# Altium schematic sheet HashPower4.SchDoc: ANT_Miner_V1.3
size A4; Date: 2013/11/20; DrawnBy: Bitmain Technology; SheetNumber: 5; SheetTotal: 9
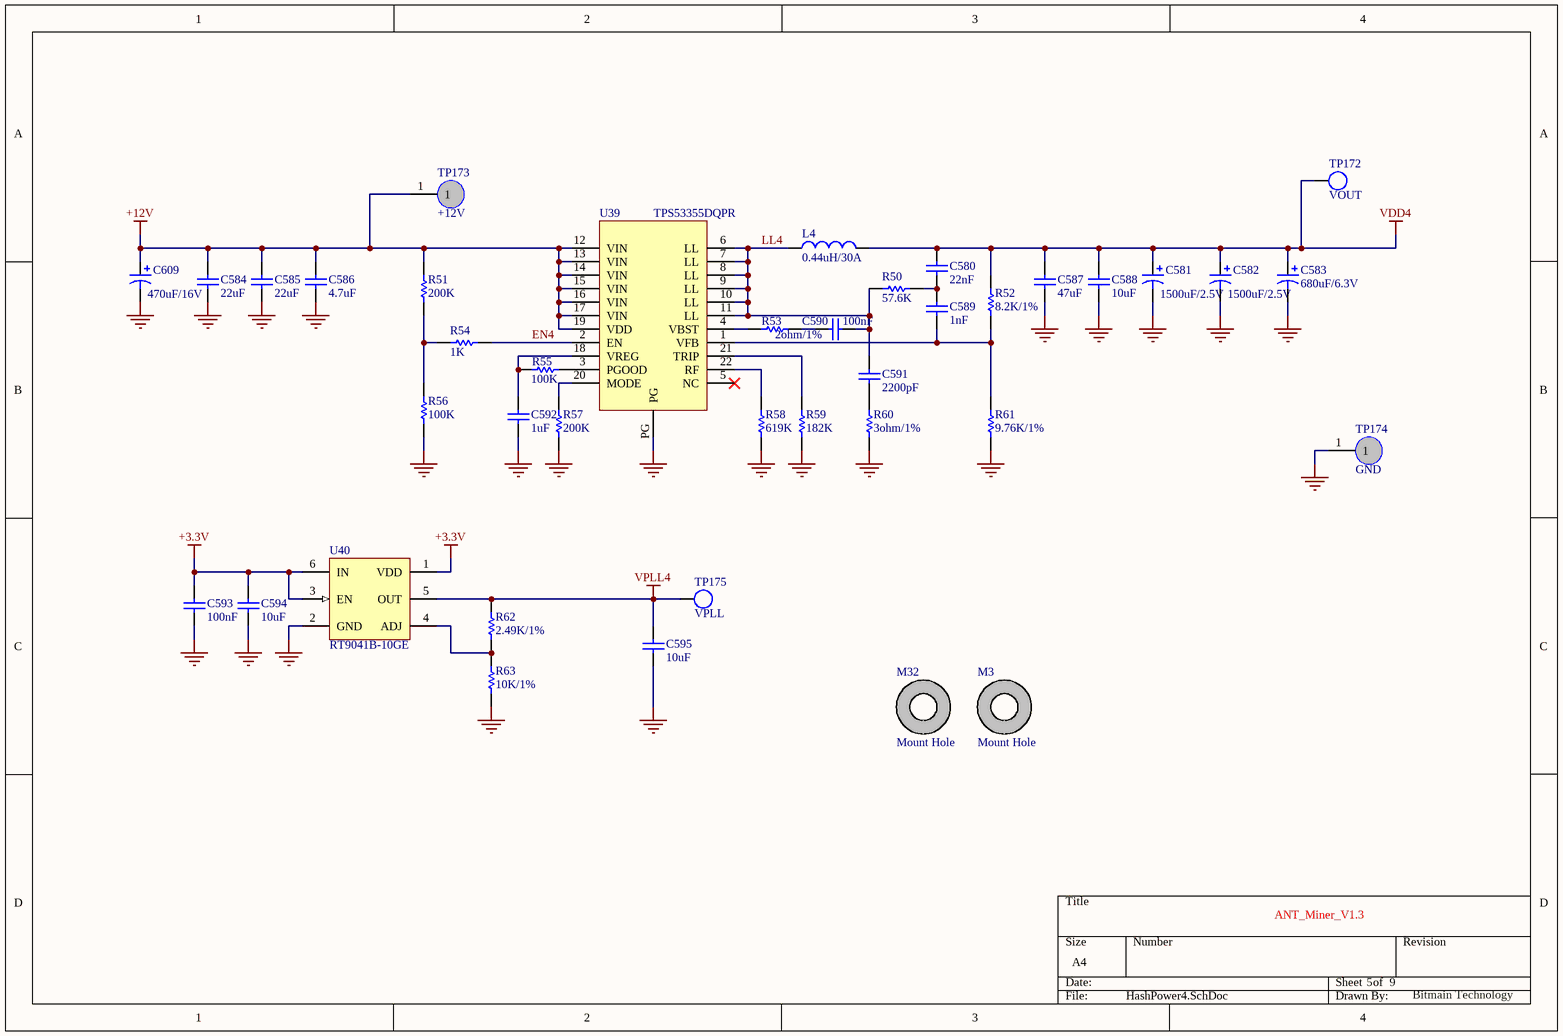
[diagram p0: HashPower4.SchDoc]

## Parts
C580  22nF  [CC0603(1608)]
C581  value 1500uF/2.5V  [F12]  (hidden comment: 1500uF/4V)
C582  value 1500uF/2.5V  [F12]  (hidden comment: 1500uF/4V)
C583  680uF/6.3V  [D]
C584  22uF  [CC1210(3225)]
C585  22uF  [CC1210(3225)]
C586  4.7uF  [CC0805(2012)]
C587  47uF  [CAPC3225L]
C588  10uF  [CAPC2012L]
C589  1nF  [CC0603(1608)]
C590  100nF  [CC0603(1608)]
C591  2200pF  [CC0603(1608)]
C592  1uF  [CC0603(1608)]
C593  100nF  [CC0603(1608)]
C594  10uF  [CC0805(2012)]
C595  10uF  [CC0805(2012)]
C609  470uF/16V  [E12]
L4  0.44uH/30A  [IHLP5050]
M3  Mount Hole  [HOLE_3.2]
M32  Mount Hole  [HOLE_3.2]
R50  57.6K  [RR0603(1608)]
R51  200K  [RR0603(1608)]
R52  8.2K/1%  [RR0603(1608)]
R53  value 2ohm/1%  [RR0603(1608)]  (hidden comment: 2)
R54  1K  [RR0603(1608)]
R55  100K  [RR0603(1608)]
R56  100K  [RR0603(1608)]
R57  200K  [RR0603(1608)]
R58  619K  [RR0603(1608)]
R59  182K  [RR0603(1608)]
R60  value 3ohm/1%  [RR0603(1608)]  (hidden comment: 3)
R61  9.76K/1%  [RR0603(1608)]
R62  2.49K/1%  [RR0603(1608)]
R63  10K/1%  [RR0603(1608)]
TP172  VOUT  [TP_SMD_1.0]
TP173  +12V  [TP]
TP174  GND  [TP]
TP175  VPLL  [TP_SMD_1.0]
U39  TPS53355DQPR  [TPS53355]
U40  RT9041B-10GE  [SOT23-6_L]

## Nets
+3.3V: C593.2 C594.2 U40.1(VDD) U40.3(EN) U40.6(IN)
+12V: C584.1 C585.1 C586.1 C609.1 R51.1 TP173.1 U39.12(VIN) U39.13(VIN) U39.14(VIN) U39.15(VIN) U39.16(VIN) U39.17(VIN) U39.19(VDD)
GND: C581.2 C582.2 C583.2 C584.2 C585.2 C586.2 C587.1 C588.1 C592.2 C593.1 C594.1 C595.1 C609.2 R56.2 R57.2 R58.2 R59.2 R60.2 R61.2 R63.1 TP174.1 U39.PG U40.2(GND)
VDD4: C580.1 C581.1 C582.1 C583.1 C587.2 C588.2 L4.2 R52.1 TP172.1
VPLL4: C595.2 R62.2 TP175.1 U40.5(OUT)
EN4: R54.2 U39.2(EN)
LL4: C590.2 C591.1 L4.1 R50.1 U39.6(LL) U39.7(LL) U39.8(LL) U39.9(LL) U39.10(LL) U39.11(LL)
NetC580_2: C580.2 C589.1 R50.2
NetC589_2: C589.2 R52.2 R61.1 U39.1(VFB)
NetC590_1: C590.1 R53.2
NetC591_2: C591.2 R60.1
NetC592_1: C592.1 R55.1 U39.18(VREG)
NetR51_2: R51.2 R54.1 R56.1
NetR53_1: R53.1 U39.4(VBST)
NetR55_2: R55.2 U39.3(PGOOD)
NetR57_1: R57.1 U39.20(MODE)
NetR58_1: R58.1 U39.22(RF)
NetR59_1: R59.1 U39.21(TRIP)
NetR62_1: R62.1 R63.2 U40.4(ADJ)

Not connected (* = marked no-connect by the designer): M3 0(PIN); M32 0(PIN); U39 5(NC)*

## Library data of the parts
C580 C584-C586 C589-C592 = Cap: Capacitor
  C580: Value: 22nF
  C584 C585: Value: 22uF
  C586: Value: 4.7uF
  C589: Value: 1nF
  C590: Value: 100nF
  C591: Value: 2200pF
  C592: Value: 1uF
C581 C582 C609 = Cap Pol2: Polarized Capacitor (SMD)
  C609: Value: 470uF/16V
C583 = Cap Pol3: Polarized Capacitor (Surface Mount); Published: 8-Jun-2000; LatestRevisionDate: 29-May-2009; LatestRevisionNote: IPC-7351 Footprint Added.; PackageReference: C0805; Publisher: Altium Limited; PackageDescription: Chip Capacitor; Value: 680uF/6.3V
C587 C588 C593-C595 = Cap Semi: Capacitor (Semiconductor SIM Model); Published: 8-Jun-2000; LatestRevisionDate: 29-May-2009; LatestRevisionNote: IPC-7351 Footprint Added.; PackageReference: C1206; Publisher: Altium Limited; PackageDescription: Chip Capacitor
  C587: Value: 47uF
  C588 C594 C595: Value: 10uF
  C593: Value: 100nF
L4 = Inductor: Code_IEC: 1005; Published: 8-Jun-2000; LatestRevisionDate: 29-May-2009; LatestRevisionNote: IPC-7351 Footprint Added.; PackageReference: 0402-A; Publisher: Altium Limited; PackageDescription: Chip Inductor; Code_JEITA: 0402; Value: 0.44uH/30A
M3 M32 = M_Hole
R50-R63 = Res1: Resistor
  R50: Value: 57.6K
  R51 R57: Value: 200K
  R52: Value: 8.2K/1%
  R54: Value: 1K
  R55 R56: Value: 100K
  R58: Value: 619K
  R59: Value: 182K
  R61: Value: 9.76K/1%
  R62: Published: 8-Jun-2000; LatestRevisionDate: 17-Jul-2002; LatestRevisionNote: Re-released for DXP Platform.; PackageReference: AXIAL-0.3; Publisher: Altium Limited; PackageDescription: Axial Device, Thru-Hole; 2 Leads; 0.3 in Pin Spacing; Value: 2.49K/1%
  R63: Published: 8-Jun-2000; LatestRevisionDate: 17-Jul-2002; LatestRevisionNote: Re-released for DXP Platform.; PackageReference: AXIAL-0.3; Publisher: Altium Limited; PackageDescription: Axial Device, Thru-Hole; 2 Leads; 0.3 in Pin Spacing; Value: 10K/1%
TP172 TP175 = TP: Test Point
  TP172: Value: VOUT
  TP175: Value: VPLL
TP173 TP174 = TP
U39 = TPS53355